# EAGLE design ButtonPCB (EAGLE 7.7.0)
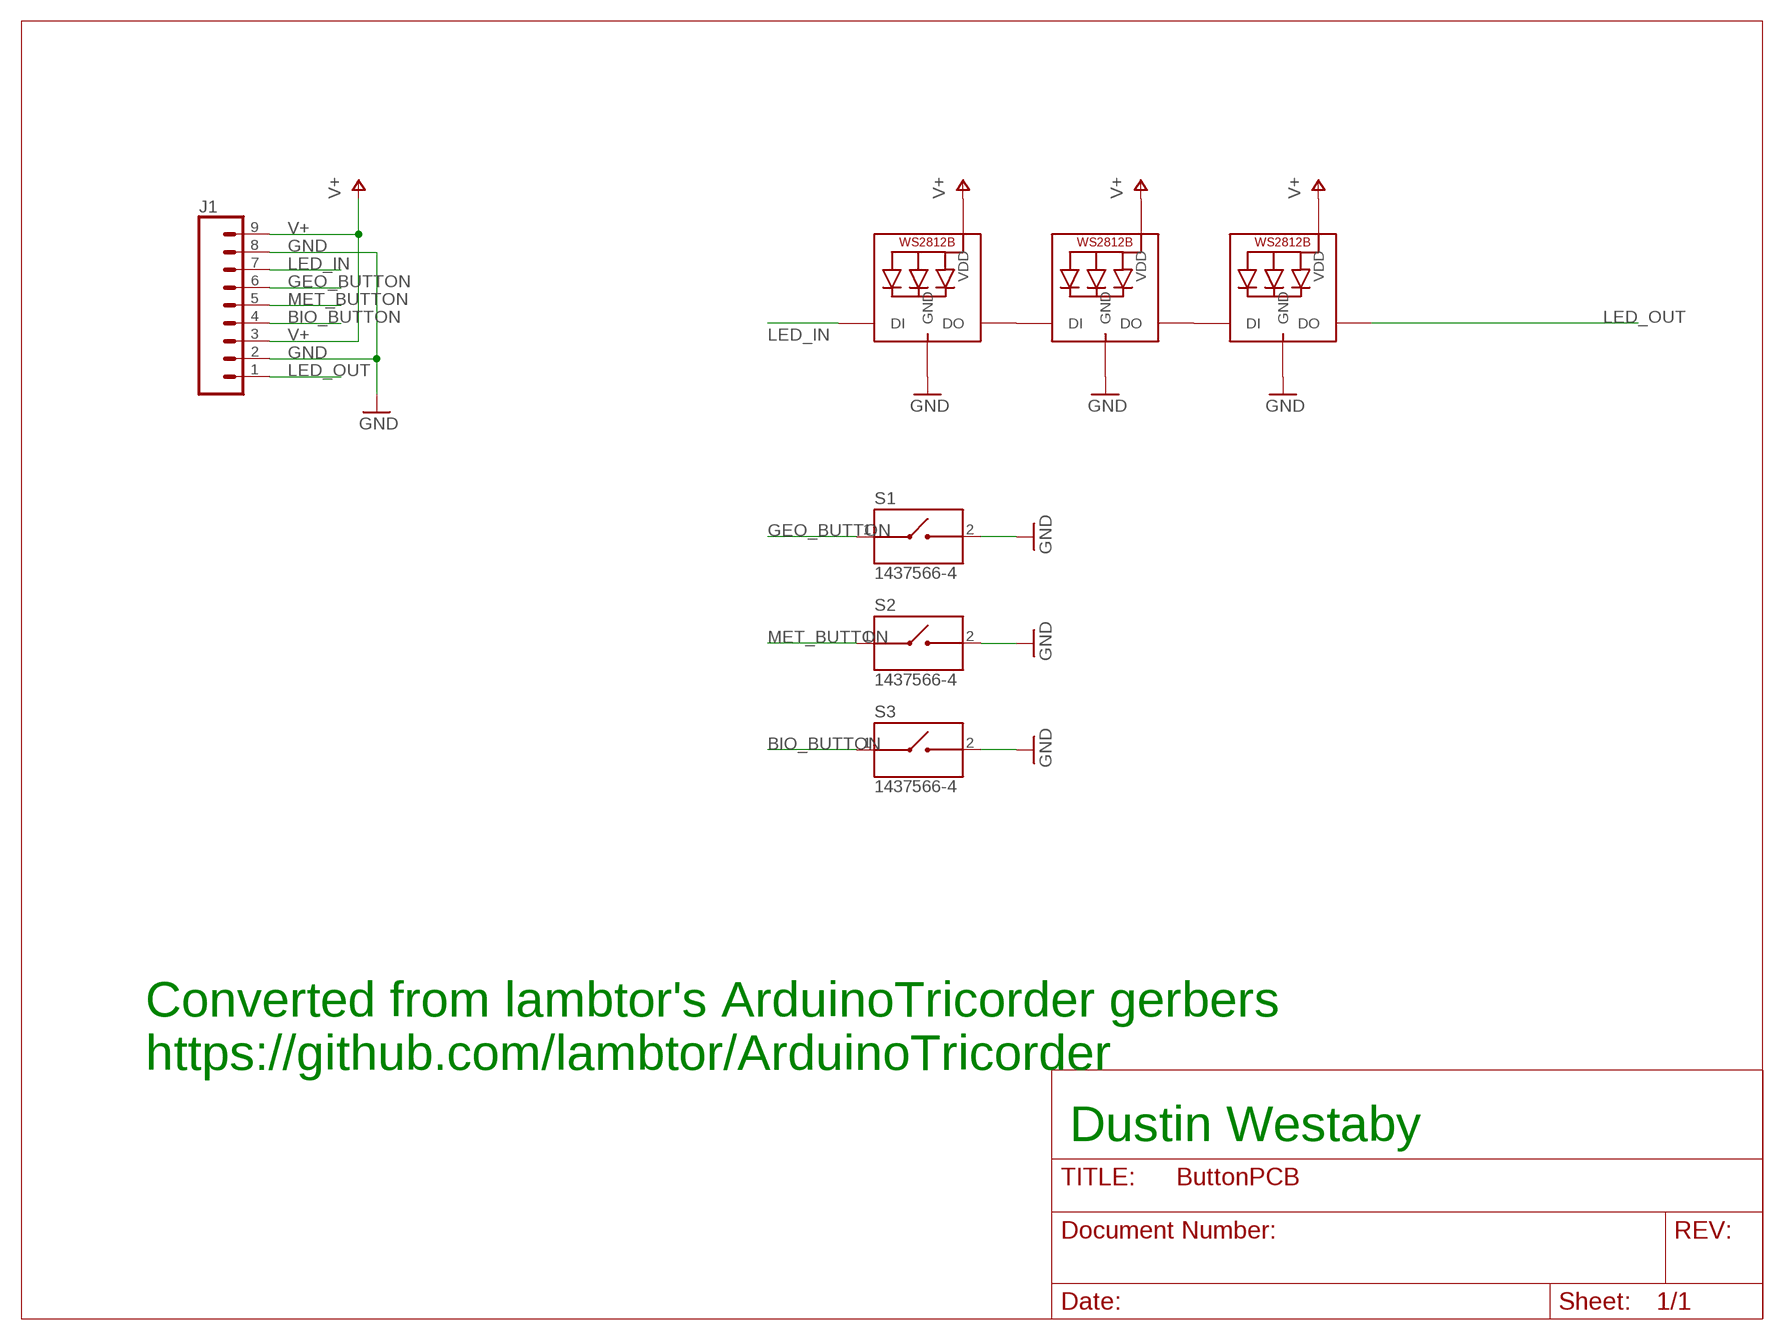
[diagram p0: schematic, sheet 1]

## Parts
J1  CONN_09  [1X09]
LED1  WS2812B_4020  [WS2812B_4020]
LED2  WS2812B_4020  [WS2812B_4020]
LED3  WS2812B_4020  [WS2812B_4020]
S1  1437566-4  [SW_1437566-4]
S2  1437566-4  [SW_1437566-4]
S3  1437566-4  [SW_1437566-4]

## Nets
BIO_BUTTON: J1.4 S3.1
GEO_BUTTON: J1.6 S1.1
GND: J1.2 J1.8 LED1.4(GND) LED2.4(GND) LED3.4(GND) S1.2 S2.2 S3.2
LED_IN: J1.7 LED2.1(DI)
LED_OUT: J1.1 LED3.3(DO)
MET_BUTTON: J1.5 S2.1
N$6: LED1.1(DI) LED2.3(DO)
N$7: LED1.3(DO) LED3.1(DI)
V+ [power]: J1.3 J1.9 LED1.2(VDD) LED2.2(VDD) LED3.2(VDD)

## Notes on the sheet
- Converted from lambtor's ArduinoTricorder gerbers
- https://github.com/lambtor/ArduinoTricorder
- Dustin Westaby

## Library data of the parts
J1 = SparkFun-Connectors:CONN_09: Multi connection point. Often used as Generic Header-pin footprint for 0.1 inch spaced/style header connections On any of the 0.1 inch spaced packages, you can populate with these: Break Away Headers - Straight <https://www.sparkfun.com/products/116> (PRT-00116) Break Away Male Headers - Right Angle <https://www.sparkfun.com/products/553> (PRT-00553) Female Headers <https://www.sparkfun.com/products/115> (PRT-00115) Break Away Headers - Machine Pin <https://www.sparkfun.com/products/117> (PRT-00117) Break Away Female Headers - Swiss Machine Pin <https://www.sparkfun.com/products/743> (PRT-00743) For SCREWTERMINALS and SPRING TERMINALS visit here: Screw Terimnals on SparkFun.com <https://www.sparkfun.com/search/results?term=Screw+Terminals> (5mm/3.5mm/2.54mm spacing) This device is also useful as a general connection point to wire up your design to another part of your project. Our various solder wires solder well into these plated through hole pads. Hook-Up Wire - Assortment (Stranded, 22 AWG) <https://www.sparkfun.com/products/11375> (PRT-11375) Hook-Up Wire - Assortment (Solid Core, 22 AWG) <https://www.sparkfun.com/products/11367> (PRT-11367) View the entire wire category on our website here <https://www.sparkfun.com/categories/141> Special notes: Molex polarized connector foot print use with SKU : PRT-08231 with associated crimp pins and housings. 1MM SMD Version SKU: PRT-10208 NOTES ON THE VARIANTS LOCK and LOCK_LONGPADS... This footprint was designed to help hold the alignment of a through-hole component (i.e. 6-pin header) while soldering it into place. You may notice that each hole has been shifted either up or down by 0.005 of an inch from it's more standard position (which is a perfectly straight line). This slight alteration caused the pins (the squares in the middle) to touch the edges of the holes. Because they are alternating, it causes a "brace" to hold the component in place. 0.005 has proven to be the perfect amount of "off-center" position when using our standard breakaway headers. Although looks a little odd when you look at the bare footprint, once you have a header in there, the alteration is very hard to notice. Also,if you push a header all the way into place, it is covered up entirely on the bottom side.
LED1-LED3 = microbuilder:WS2812B
S1-S3 = FSMSMTR-1437566-4:1437566-4: SWITCH TACTILE SPST-NO 0.05A 24V; COMMENT: 1437566-4; CONFIGURATION_POLE-THROW: Single Pole - Single Throw; CONTACT_CURRENT_RATING: 50 mA; DESCRIPTION: Tactile Switch SPST-NO Top Actuated Surface Mount; DIGI-KEY_PART_NUMBER: 2266-1437569-2TR-ND; MF: TE Connectivity; MP: 1437566-4; PACKAGE: None

## Net classes
1 power: width 0.305 mm

## Board
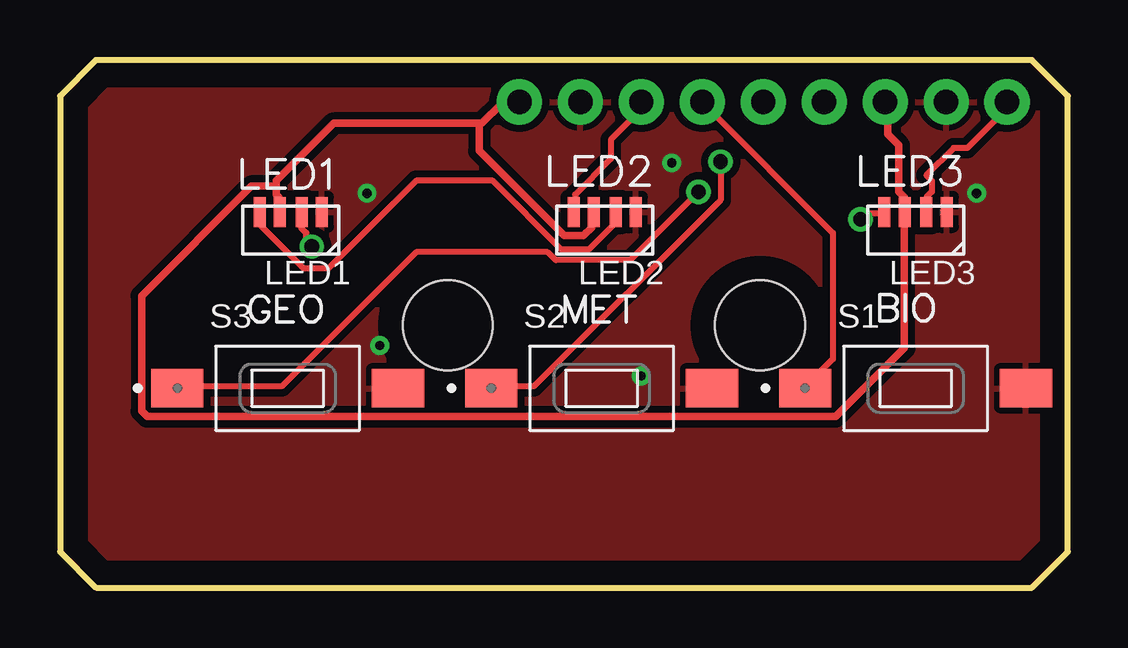
[diagram p1: board, top side]
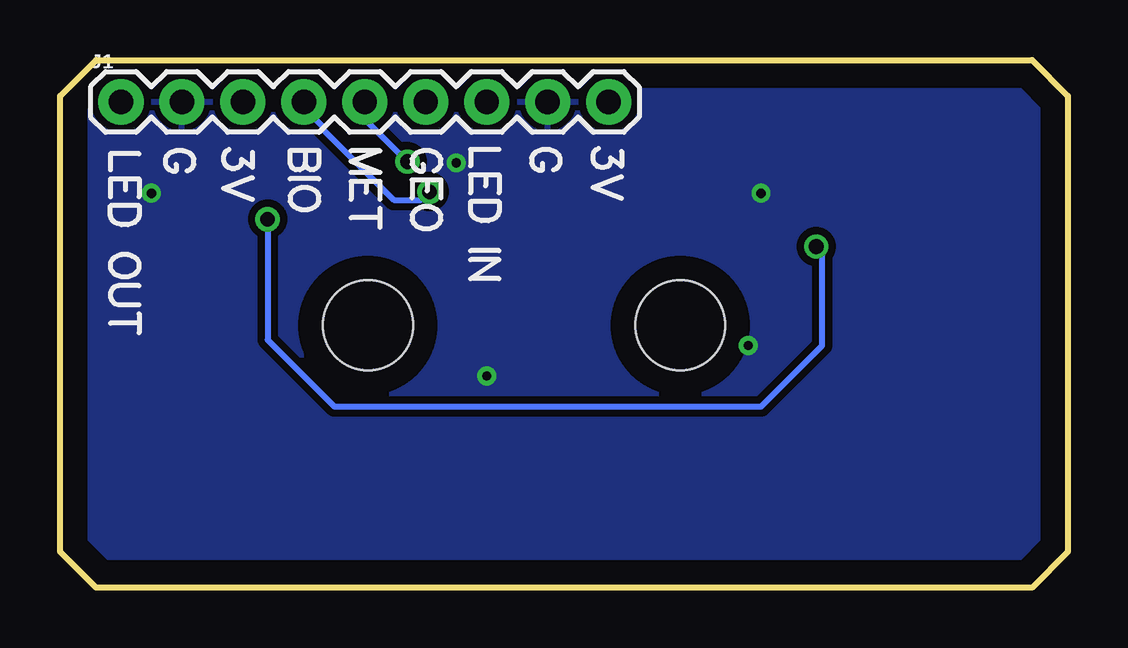
[diagram p2: board, bottom side, seen from below]

Size 42 x 22 mm. Coordinates in mm from the lower left corner, seen from the top.
Outline: 42,1.5 42,1.5
Outline: 42,1.5 42,20.5 40.5,22 1.5,22 0,20.5 0,1.5
Outline: 40.5,0 1.5,0 0,1.5
Outline: 40.5,0 40.5,0
Outline: 0,1.5 0,1.5
Outline: 40.5,0 42,1.5
Copper layers (1*16): Top 0.035mm / dielectric 1.5mm / Bottom 0.035mm
Design rules "default *": minimum track width 10mil, minimum drill 24mil, track to track 8mil, track to pad 8mil, pad to pad 8mil, via to via 8mil, smd to smd 8mil, copper to edge 40mil, drill to drill 8mil, minimum pad ring 10mil, minimum via ring 8mil, stop-mask expansion 4mil, vias tented up to drill 25mil, thermal gap 10mil
Holes 3.75 mm at 16.16,10.93 29.17,10.93

### Footprints (pad centres in the part's own frame; a part is rotated, then mirrored left to right if it is on the bottom)
1X09 = drill 1.016 pad 1.88: 1 0,0; 2 2.54,0; 3 5.08,0; 4 7.62,0; 5 10.16,0; 6 12.7,0; 7 15.24,0; 8 17.78,0; 9 20.32,0
WS2812B_4020 = smd 0.5 x 1.25: 1 1.3,-0.75; 2 0.45,-0.75; 3 -0.45,-0.75; 4 -1.3,-0.75
SW_1437566-4 = smd 2.18 x 1.6: 1 -4.6,0; 2 4.6,0

### Placement (x,y rotation side)
J1  39.46,20.25 0 bottom
LED1  9.61,14.92 180 top
LED2  22.7,14.92 180 top
LED3  35.65,14.92 180 top
S1  35.65,8.31 0 top
S2  22.57,8.31 0 top
S3  9.49,8.31 0 top

### Tracks (layer width: path | path; a pad name or v marks a point on that pad's centre or on a via)
BIO_BUTTON  (via drill 0.61)
  Top 0.254: v26.61,16.5 23.75,13.65 20.66,13.65 20.32,13.99 14.83,13.99 9.23,8.39 4.89,8.39 S3.1
  Bottom 0.254: v26.61,16.5 26.95,16.16 28.09,16.16 31.06,19.13 31.06,19.25 31.75,19.93 31.75,20.16 J1.4
GEO_BUTTON
  Top 0.254: S1.1 31.06,8.39 32.21,9.53 32.21,14.79 26.84,20.16 J1.6
GND  (via drill 0.38)
  other vias: 12.79,16.44 38.19,16.44 25.49,17.71 24.22,8.82 13.33,10.09
  pour Bottom (isolate 0.305): 0.09,22.79 0.09,-0.07 42,-0.07 42,22.79
  pour Top (isolate 0.305): 0.09,22.79 0.09,-0.07 42,-0.07 42,22.79
LED_IN
  Top 0.254: LED2.1 21.46,15.7 21.46,16.39 22.95,17.88 22.95,18.68 24.21,19.93 24.21,20.16 J1.7
LED_OUT
  Top 0.254: LED3.3 36.09,15.7 36.09,16.27 36.32,16.5 36.32,16.96 36.09,17.19 37.24,18.33 37.81,18.33 39.41,19.93 39.41,20.16 J1.1
MET_BUTTON  (via drill 0.61)
  Top 0.254: v27.52,17.76 27.52,16.16 19.75,8.39 18.03,8.39 S2.1
  Bottom 0.254: v27.52,17.76 29.24,19.48 29.24,20.16 J1.5
N$6
  Top 0.254: LED1.1 8.32,15.59 8.32,15.13 10.15,13.3 11.18,13.3 14.83,16.96 18.03,16.96 20.89,14.1 22.04,14.1 23.06,15.13 23.06,15.59 LED2.3
N$7  (via drill 0.61)
  Top 0.254: v10.49,14.22 10.26,14.45 10.26,14.79 10.03,15.02 10.03,15.59 LED1.3 | v33.35,15.36 33.58,15.59 34.27,15.59 LED3.1
  Bottom 0.254: v33.35,15.36 33.35,10.33 30.57,7.55 12.79,7.55 10.25,10.09 10.25,13.98 v10.49,14.22
V+
  Top 0.305: J1.3 34.38,20.16 34.49,20.05 34.49,18.9 34.95,18.45 34.95,16.5 35.18,16.27 35.18,15.7 LED3.2 35.18,15.59 35.18,9.99 32.32,7.13 3.63,7.13 3.4,7.36 3.4,12.16 7.98,16.73 9,16.73 | 9,16.73 9,16.96 11.41,19.36 17.46,19.36 | 9,16.73 9,16.39 9.12,16.27 9.12,15.7 LED1.2 | 17.46,19.36 17.58,19.36 18.38,20.16 19.06,20.16 J1.9 | 17.46,19.36 17.46,18.22 21.01,14.67 21.81,14.67 22.15,15.02 22.15,15.59 LED2.2
  Bottom 0.305: 19.18,20.16 J1.9